# EAGLE design ASM2028 (EAGLE 6.3)
DATABASE: ./../../../../../Components/TinyCircuits_Part_Database.txt
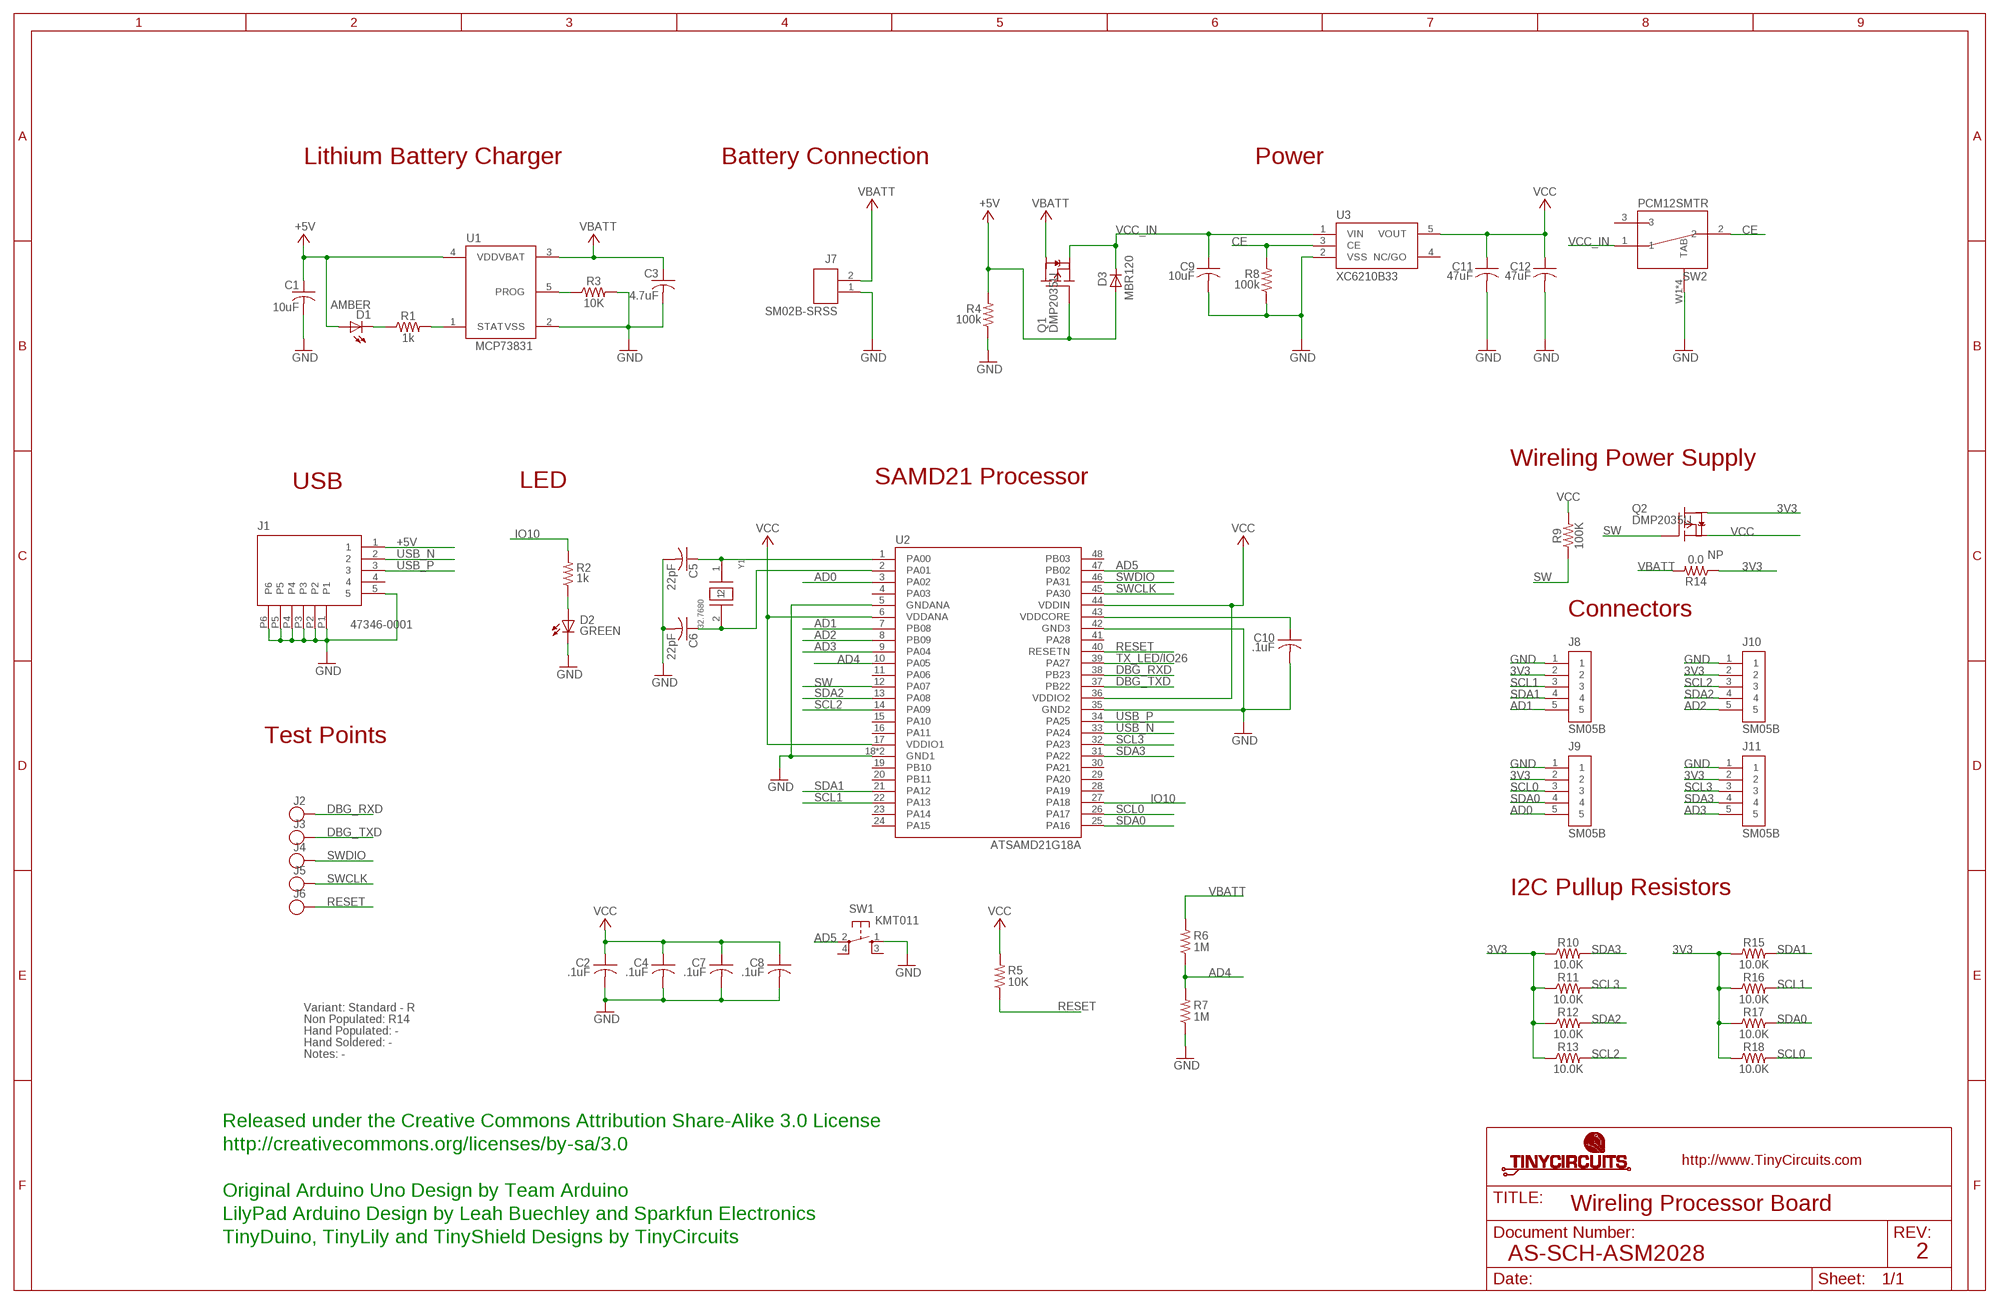
[diagram p0: schematic, sheet 1]

## Parts
C1  10uF  AS-ITM-00002  [C0603]
C2  .1uF  AS-ITM-00008  [C0402]
C3  4.7uF  AS-ITM-00088  [C0603]
C4  .1uF  AS-ITM-00008  [C0402]
C5  22pF  AS-ITM-00211  [C0402]
C6  22pF  AS-ITM-00211  [C0402]
C7  .1uF  AS-ITM-00008  [C0402]
C8  .1uF  AS-ITM-00008  [C0402]
C9  10uF  AS-ITM-00002  [C0603]
C10  .1uF  AS-ITM-00008  [C0402]
C11  47uF  AS-ITM-00558  [C0603]
C12  47uF  AS-ITM-00558  [C0603]
D1  AMBER  AS-ITM-00058  [0402_LED]
D2  GREEN  AS-ITM-00038  [0402_LED]
D3  MBR120  AS-ITM-00111  [SOD-123FL]
J1  47346-0001  AS-ITM-00021  [MICRO_USB]
J2  TEST_POINT  [TEST_POINT_1MM]
J3  TEST_POINT  [TEST_POINT_1MM]
J4  TEST_POINT  [TEST_POINT_1MM]
J5  TEST_POINT  [TEST_POINT_1MM]
J6  TEST_POINT  [TEST_POINT_1MM]
J7  SM02B-SRSS  AS-ITM-00231  [JST_SH_2X1]
J8  SM05B  AS-ITM-00340EDGE  [JST_SH_5X1_EDGE]
J9  SM05B  AS-ITM-00340EDGE  [JST_SH_5X1_EDGE]
J10  SM05B  AS-ITM-00340EDGE  [JST_SH_5X1_EDGE]
J11  SM05B  AS-ITM-00340EDGE  [JST_SH_5X1_EDGE]
Q1  DMP2035U  AS-ITM-00024A  [SOT23A]
Q2  DMP2035U  AS-ITM-00024A  [SOT23A]
R1  1k  AS-ITM-00003  [0402]
R2  1k  AS-ITM-00003  [0402]
R3  10K  AS-ITM-00032  [0402]
R4  100k  AS-ITM-00004  [0402]
R5  10K  AS-ITM-00032  [0402]
R6  1M  AS-ITM-00005  [0402]
R7  1M  AS-ITM-00005  [0402]
R8  100k  AS-ITM-00004  [0402]
R9  100K  AS-ITM-00004  [0402]
R10  10.0K  AS-ITM-00032  [0402]
R11  10.0K  AS-ITM-00032  [0402]
R12  10.0K  AS-ITM-00032  [0402]
R13  10.0K  AS-ITM-00032  [0402]
R14  0.0  AS-ITM-00076  [0402]
R15  10.0K  AS-ITM-00032  [0402]
R16  10.0K  AS-ITM-00032  [0402]
R17  10.0K  AS-ITM-00032  [0402]
R18  10.0K  AS-ITM-00032  [0402]
SW1  KMT011  AS-ITM-00041  [KMT011]
SW2  PCM12SMTR  AS-ITM-00220  [PCM12SMTR]
U1  MCP73831  AS-ITM-00136  [SOT-23]
U2  ATSAMD21G18A  AS-ITM-00273  [QFN48]
U3  XC6210B33  AS-ITM-00046  [SOT-25]
Y1  32.7680  AS-ITM-00279  [ABS06]

## Nets
3V3: J8.2 J9.2 J10.2 J11.2 Q2.C(D) R10.1 R11.1 R12.1 R13.1 R14.1 R15.1 R16.1 R17.1 R18.1
+5V: C1.1 D1.1(A) D3.A J1.1 Q1.B(G) R4.2 U1.4(VDD)
AD0: J9.5 U2.3(PA02)
AD1: J8.5 U2.7(PB08)
AD2: J10.5 U2.8(PB09)
AD3: J11.5 U2.9(PA04)
AD4: R6.1 R7.2 U2.10(PA05)
AD5: SW1.2 U2.47(PB02)
CE: R8.2 SW2.2 U3.3(CE)
DBG_RXD: J2.P$1 U2.38(PB23)
DBG_TXD: J3.P$1 U2.37(PB22)
GND: C1.2 C2.2 C3.2 C4.2 C5.2 C6.2 C7.2 C8.2 C9.2 C10.2 C11.2 C12.2 D2.2(C) J1.5 J1.P1 J1.P2 J1.P3 J1.P4 J1.P5 J1.P6 J7.1 J8.1 J9.1 J10.1 J11.1 R3.2 R4.1 R7.1 R8.1 SW1.1 SW2.W1(TAB) SW2.W2(TAB) SW2.W3(TAB) SW2.W4(TAB) U1.2(VSS) U2.5(GNDANA) U2.18(GND1) U2.35(GND2) U2.42(GND3) U2.EXP(GND1) U3.2(VSS)
IO10: R2.2 U2.27(PA18)
N$1: C5.1 U2.1(PA00) Y1.1
N$3: C6.1 U2.2(PA01) Y1.2
N$4: D2.1(A) R2.1
N$5: D1.2(C) R1.1
N$6: R3.1 U1.5(PROG)
N$7: R1.2 U1.1(STAT)
N$8: C10.1 U2.43(VDDCORE)
RESET: J6.P$1 R5.1 U2.40(RESETN)
SCL0: J9.3 R18.2 U2.26(PA17)
SCL1: J8.3 R16.2 U2.22(PA13)
SCL2: J10.3 R13.2 U2.14(PA09)
SCL3: J11.3 R11.2 U2.32(PA23)
SDA0: J9.4 R17.2 U2.25(PA16)
SDA1: J8.4 R15.2 U2.21(PA12)
SDA2: J10.4 R12.2 U2.13(PA08)
SDA3: J11.4 R10.2 U2.31(PA22)
SW: Q2.B(G) R9.1 U2.12(PA07)
SWCLK: J5.P$1 U2.45(PA30)
SWDIO: J4.P$1 U2.46(PA31)
TX_LED/IO26: U2.39(PA27)
USB_N: J1.2 U2.33(PA24)
USB_P: J1.3 U2.34(PA25)
VBATT: C3.1 J7.2 Q1.C(D) R6.2 R14.2 U1.3(VBAT)
VCC: C2.1 C4.1 C7.1 C8.1 C11.1 C12.1 Q2.E(S) R5.2 R9.2 U2.6(VDDANA) U2.17(VDDIO1) U2.36(VDDIO2) U2.44(VDDIN) U3.5(VOUT)
VCC_IN: C9.1 D3.C Q1.E(S) SW2.1 U3.1(VIN)
Unconnected: J1.4 SW1.3 SW1.4 SW2.3 U2.4(PA03) U2.11(PA06) U2.15(PA10) U2.16(PA11) U2.19(PB10) U2.20(PB11) U2.23(PA14) U2.24(PA15) U2.28(PA19) U2.29(PA20) U2.30(PA21) U2.41(PA28) U2.48(PB03) U3.4(NC/GO)

## Notes on the sheet
- Lithium Battery Charger | Battery Connection | Power
- Wireling Power Supply
- USB | LED | SAMD21 Processor
- NP
- Connectors
- Test Points
- I2C Pullup Resistors
- Variant: Standard - R
- Non Populated: R14
- Hand Populated: -
- Hand Soldered: -
- Notes: -
- Released under the Creative Commons Attribution Share-Alike 3.0 License
- http://creativecommons.org/licenses/by-sa/3.0
- Original Arduino Uno Design by Team Arduino
- Wireling Processor Board
- LilyPad Arduino Design by Leah Buechley and Sparkfun Electronics
- TinyDuino, TinyLily and TinyShield Designs by TinyCircuits
- AS-SCH-ASM2028 | 2

## Library data of the parts
C1 C9 = tinycircuits:AS-ITM-00002: CAP CER 10UF 10V 20% X5R 0603; PARTNO: AS-ITM-00002
C2 C4 C7 C8 C10 = tinycircuits:AS-ITM-00008: CAP CER 0.1UF 16V 10% X5R 0402; PARTNO: AS-ITM-00008; VALUE: 0.1uF
C3 = tinycircuits:AS-ITM-00088: CAP CER 4.7UF 6.3V 20% X5R 0603; PARTNO: AS-ITM-00088
C5 C6 = tinycircuits:AS-ITM-00211: CAP CER 22PF 50V 2% NP0 0402; PARTNO: AS-ITM-00211
C11 C12 = tinycircuits:AS-ITM-00558: CAP CER 47UF 6.3V 20% X5R 0603; PARTNO: AS-ITM-00558
D1 = tinycircuits:AS-ITM-00058: LED 0402 AMBER WTR CLR SMD; PARTNO: AS-ITM-00058
D2 = tinycircuits:AS-ITM-00038: LED 0402 GREEN WTR CLR SMD; PARTNO: AS-ITM-00038; PNPROTATION: 0
D3 = tinycircuits:AS-ITM-00111: DIODE SCHOTTKY 20V 1A SOD123L; PARTNO: AS-ITM-00111; PNPROTATION: 0; VALUE: MBR120VLSFT1G
J1 = tinycircuits:AS-ITM-00021: CONN RCPT 5POS MICRO USB R/A; PARTNO: AS-ITM-00021; PNPROTATION: 90
J2-J6 = tinycircuits:TEST_POINT: Test point, no drill
J7 = tinycircuits:AS-ITM-00231: CONN HEADER SH 2POS SIDE 1MM; PARTNO: AS-ITM-00231; PNPROTATION: 180; VALUE: SM02B-SRSS-TB(LF)(SN)
J8-J11 = tinycircuits:AS-ITM-00340: CONN HEADER SH 5POS SIDE 1MM TIN; PARTNO: AS-ITM-00340; PNPROTATION: 180
Q1 Q2 = tinycircuits:AS-ITM-00024: P-Channel MOSFET SOT-23; PARTNO: AS-ITM-00024; PNPROTATION: 0
R1 R2 = tinycircuits:AS-ITM-00003: RES 1.00K OHM 1/16W 1% 0402; PARTNO: AS-ITM-00003; VALUE: 1.00K
R3 R5 = tinycircuits:AS-ITM-00032: RES 10.0K OHM 1/16W 1% 0402 SMD; PARTNO: AS-ITM-00032; VALUE: 10.0K
R4 R8 = tinycircuits:AS-ITM-00004: RES 100K OHM 1/16W 1% 0402; PARTNO: AS-ITM-00004; VALUE: 100K
R6 R7 = tinycircuits:AS-ITM-00005: RES 1.00M OHM 1/16W 1% 0402; PARTNO: AS-ITM-00005; VALUE: 1.00M
R9 = tinycircuits:AS-ITM-00004: RES 100K OHM 1/16W 1% 0402; PARTNO: AS-ITM-00004
R10-R13 R15-R18 = tinycircuits:AS-ITM-00032: RES 10.0K OHM 1/16W 1% 0402 SMD; PARTNO: AS-ITM-00032
R14 = tinycircuits:AS-ITM-00076: RES 0.0 OHM 1/16W 1% 0402 SMD; PARTNO: AS-ITM-00076
SW1 = tinycircuits:AS-ITM-00041: SWITCH TACTILE SPST-NO 0.05A 32V; PARTNO: AS-ITM-00041
SW2 = tinycircuits:AS-ITM-00220: SW SLIDE SP2T 6VDC 0.3A SMT; PARTNO: AS-ITM-00220; PNPROTATION: 0
U1 = tinycircuits:AS-ITM-00136: IC CONTROLLER LI-ION 4.2V SOT23-5; PARTNO: AS-ITM-00136; PNPROTATION: 270
U2 = tinycircuits:AS-ITM-00273: IC MCU 32BIT 256KB FLASH 48QFN; PARTNO: AS-ITM-00273; PNPROTATION: 270
U3 = tinycircuits:AS-ITM-00046: IC REG LDO 3.3V .7A SOT-25; PARTNO: AS-ITM-00046; PNPROTATION: 270
Y1 = tinycircuits:AS-ITM-00279: Crystal 32.7680kHz 20ppm 12.5pF; PARTNO: AS-ITM-00279; PNPROTATION: 0

## Board
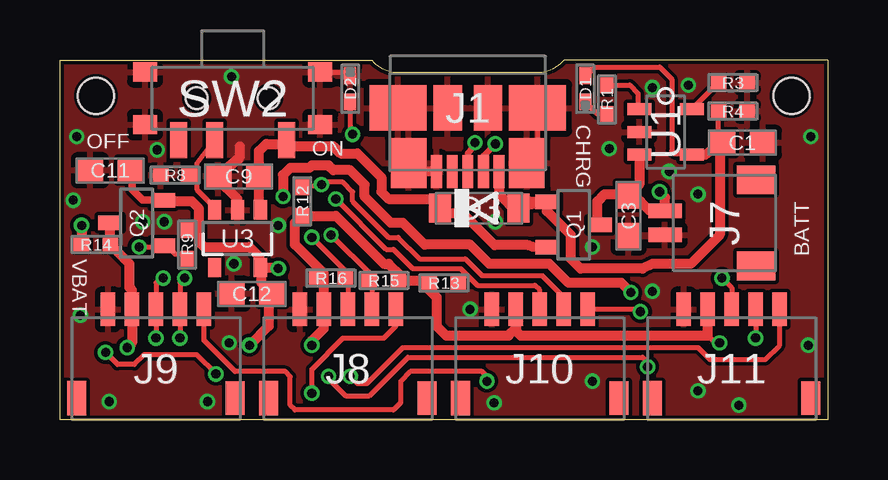
[diagram p1: board, top side]
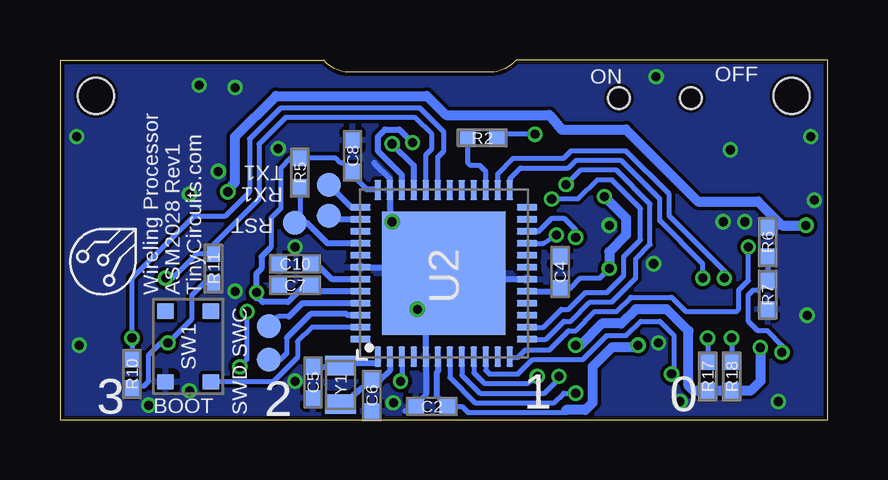
[diagram p2: board, bottom side, seen from below]

Size 32 x 15 mm. Coordinates in mm from the lower left corner, seen from the top.
Outline: 32,15 21,15 arc-45 20.1,14.5 13.9,14.5 arc-45 13,15 0,15 0,0 32,0 32,15
Copper layers (1*16): Top 0.035mm / dielectric 1.5mm / Bottom 0.035mm
Design rules "default *": minimum track width 8mil, minimum drill 15mil, track to track 6mil, track to pad 6mil, pad to pad 6mil, via to via 6mil, smd to smd 6mil, copper to edge 6mil, drill to drill 8mil, minimum pad ring 8mil, minimum via ring 5mil, stop-mask expansion 4mil, vias tented up to drill 25mil, thermal gap 10mil
Holes 1.5 mm at 30.5,13.5 1.5,13.5
bRestrict: 2 lines

### Footprints (pad centres in the part's own frame; a part is rotated, then mirrored left to right if it is on the bottom)
C0603 = smd 1.1 x 1: 1 -0.85,0; 2 0.85,0
C0402 = smd 0.65 x 0.6: 1 -0.65,0; 2 0.65,0
0402_LED = smd 0.7 x 0.5: 1 -0.55,0; 2 0.55,0
SOD-123FL = smd 0.914 x 1.219: A 1.638,0; C -1.638,0
MICRO_USB = smd 1.38 x 0.45: 1 2.66,1.3; 2 2.66,0.65; 3 2.66,0; 4 2.66,-0.65; 5 2.66,-1.3 | smd 2.1 x 1.475: P1 2.3,-2.462; P2 2.3,2.462 | smd 1.9 x 2.375: P3 0,2.913; P4 0,-2.913 | smd 1.9 x 1.175: P5 0,0.838; P6 0,-0.838
TEST_POINT_1MM = smd 1 x 1: P$1 0,0
JST_SH_2X1 = smd 0.6 x 1.4: 1 -0.5,2.475; 2 0.5,2.475 | smd 1.2 x 1.6: PAD1 -1.8,-1.325; PAD2 1.8,-1.325
JST_SH_5X1_EDGE = smd 0.6 x 1.4: 1 -2,2.475; 2 -1,2.475; 3 0,2.475; 4 1,2.475; 5 2,2.475 | smd 0.8 x 1.4: PAD1 -3.3,-1.225; PAD2 3.3,-1.225
SOT23A = smd 0.6 x 1: B -0.95,-1.1; C 0,1.1; E 0.95,-1.1
0402 = smd 0.65 x 0.55: 1 -0.6,0; 2 0.6,0
KMT011 = smd 0.65 x 0.7: 1 -1.475,0.95; 2 -1.475,-0.95; 3 1.475,0.95; 4 1.475,-0.95
PCM12SMTR = smd 0.7 x 1.5: 1 -2.25,1.75; 2 0.75,1.75; 3 2.25,1.75 | smd 1 x 0.8: W1 -3.65,1.1; W2 -3.65,-1.1; W3 3.65,-1.1; W4 3.65,1.1 | hole 0.9: 1.5,0; -1.5,0
SOT-23 = smd 0.5 x 1: 1 -0.95,-1.1; 2 0,-1.1; 3 0.95,-1.1; 4 0.95,1.1; 5 -0.95,1.1
QFN48 = smd 0.85 x 0.28: 1 -3.475,2.75; 2 -3.475,2.25; 3 -3.475,1.75; 4 -3.475,1.25; 5 -3.475,0.75; 6 -3.475,0.25; 7 -3.475,-0.25; 8 -3.475,-0.75; 9 -3.475,-1.25; 10 -3.475,-1.75; 11 -3.475,-2.25; 12 -3.475,-2.75; 25 3.475,-2.75; 26 3.475,-2.25; 27 3.475,-1.75; 28 3.475,-1.25; 29 3.475,-0.75; 30 3.475,-0.25; 31 3.475,0.25; 32 3.475,0.75; 33 3.475,1.25; 34 3.475,1.75; 35 3.475,2.25; 36 3.475,2.75 | smd 0.28 x 0.85: 13 -2.75,-3.475; 14 -2.25,-3.475; 15 -1.75,-3.475; 16 -1.25,-3.475; 17 -0.75,-3.475; 18 -0.25,-3.475; 19 0.25,-3.475; 20 0.75,-3.475; 21 1.25,-3.475; 22 1.75,-3.475; 23 2.25,-3.475; 24 2.75,-3.475; 37 2.75,3.475; 38 2.25,3.475; 39 1.75,3.475; 40 1.25,3.475; 41 0.75,3.475; 42 0.25,3.475; 43 -0.25,3.475; 44 -0.75,3.475; 45 -1.25,3.475; 46 -1.75,3.475; 47 -2.25,3.475; 48 -2.75,3.475 | smd 5.15 x 5.15: EXP 0,0
SOT-25 = smd 0.55 x 0.8: 1 -0.95,-1.2; 2 0,-1.2; 3 0.95,-1.2; 4 0.95,1.2; 5 -0.95,1.2
ABS06 = smd 0.8 x 1.3: 1 -0.8,0; 2 0.8,0

### Placement (x,y rotation side)
C1  28.45,11.55 0 top
C2  16.5,0.55 180 bottom
C3  23.7,8.5 270 top
C4  11.15,6.15 90 bottom
C5  21.45,1.55 270 bottom
C6  19,1 270 bottom
C7  22.2,5.6 180 bottom
C8  19.8,11 90 bottom
C9  7.45,10.15 180 top
C10  22.2,6.5 180 bottom
C11  2.1,10.4 180 top
C12  8,5.25 180 top
D1  21.9,13.8 270 top
D2  12.1,13.8 90 top
D3  17.48,8.82 0 top
J1  17,13 270 top
J2  20.8,8.5 90 bottom
J3  20.8,9.8 90 bottom
J4  23.3,2.5 90 bottom
J5  23.3,3.9 90 bottom
J6  22.2,8.2 90 bottom
J7  27.7,8.2 90 top
J8  12,2.12 0 top
J9  4,2.12 0 top
J10  20,2.12 0 top
J11  28,2.12 0 top
Q1  21.41,8.13 270 top
Q2  3.2,8.2 90 top
R1  22.8,13.35 90 top
R2  14.4,11.75 180 bottom
R3  28.05,14.05 0 top
R4  28.05,12.86 180 top
R5  22,10.3 90 bottom
R6  2.5,7.4 90 bottom
R7  2.5,5.2 90 bottom
R8  4.8,10.2 0 top
R9  5.3,7.3 90 top
R10  29,1.9 90 bottom
R11  25.6,6.3 90 bottom
R12  10.1,9.1 90 top
R13  16,5.7 0 top
R14  1.5,7.3 180 top
R15  13.5,5.8 180 top
R16  11.3,5.9 0 top
R17  5,1.8 90 bottom
R18  4,1.8 90 bottom
SW1  26.65,3.05 90 bottom
SW2  7.2,13.4 180 top
U1  25.25,12 270 top
U2  16,6.1 90 bottom
U3  7.4,7.55 180 top
U$1  [DOCFIELD-TINYCIRCUITS-PCB]  45,-9.9 0 top  (outside the outline)
Y1  20.3,1.45 270 bottom

### Tracks (layer width: path | path; a pad name or v marks a point on that pad's centre or on a via)
3V3  (via drill 0.38)
  Top 0.203: R16.1 10.9,5.9 11,6 | 27,3.5 27.3,3.2 v27.5,3.2 | 10.3,8.7 R12.1 | 15,5.8 15.3,5.8 R13.1 | R15.1 14.2,5.8
  Top 0.406: Q2.C R14.1 2.9,6.5 2.9,5.5 3,5.4 J9.2 3,3.2 v2.8,3 | v10.5,3.1 10.5,3.3 11,3.8 J8.2 11,6 11,6.1 9.8,7.3 9.8,8.2 R12.1 11.5,8.5 13.5,6.5 13.7,6.5 14.2,6 14.2,5.8 15,5.8 15.7,5.1 15.7,3.9 16.1,3.5 18.7,3.5 19,3.8 J10.2 19,3.7 19.2,3.5 27,3.5 J11.2
  Bottom 0.203: R11.1 26,5.7 26.5,5.2 26.5,4.2 v27.5,3.2 27.8,3.2 28.3,2.7 28.3,1.6 28.5,1.4 28.9,1.4 R10.1
  Bottom 0.406: v2.8,3 2.8,1.6 3.2,1.2 R18.1 R17.1 5.6,1.2 5.8,1.4 5.8,3.7 6.7,4.6 8,4.6 8.6,4 9.4,4 10.3,3.1 v10.5,3.1
+5V
  Top 0.203: U1.4 26.3,11.1 25.6,11.1 25.5,11.2 25.5,14.2 25,14.7 22.3,14.7 21.95,14.35 D1.1 | C1.1 27.45,11.7 R4.2
  Top 0.406: Q1.B 20.3,8.69 21.3,7.7 21.3,6.7 21.7,6.3 24.3,6.3 24.7,6.5 26.3,6.5 27.5,7.7 27.5,11.5 27.55,11.55 C1.1 26.9,11.05 U1.4 | J1.1 18.3,9.4 18.74,8.96 19.24,8.96 19.16,8.88 | 19.21,9.12 Q1.B | Q1.B 19.16,8.88 | 19.16,8.88 D3.A
AD0  (via drill 0.38)
  Top 0.203: v17.8,1.6 17.8,1.8 17.6,2 14.6,2 14.2,1.6 14.2,0.7 13.9,0.4 9.8,0.4 9.6,0.6 9.6,1.8 9.4,2 7.3,2 6,3.3 J9.5
  Bottom 0.203: U2.3 17.75,1.55 v17.8,1.6
AD1  (via drill 0.38)
  Top 0.203: v10.5,1.1 10.5,2.1 11.8,3.4 13.5,3.4 14,3.9 J8.5
  Bottom 0.203: U2.7 15.75,1.75 14.7,0.7 11.4,0.7 11,1.1 v10.5,1.1
AD2  (via drill 0.38)
  Top 0.203: v11.2,1.8 11.2,1.7 11.9,1 12.9,1 14.5,2.6 24.3,2.6 24.5,2.4 v24.5,2.2 | v24.2,4.5 24.1,4.6 J10.5
  Bottom 0.203: U2.8 15.25,1.85 14.5,1.1 11.8,1.1 11.2,1.7 v11.2,1.8 | v24.5,2.2 24.2,2.5 v24.2,4.5
AD3  (via drill 0.38)
  Top 0.203: v12.1,1.8 12.4,1.5 12.8,1.5 14.3,3 26.6,3 27.1,2.5 29.4,2.5 30,3.1 J11.5
  Bottom 0.203: U2.9 14.75,1.95 14.3,1.5 12.5,1.5 v12.1,1.8
AD4  (via drill 0.38)
  Top 0.203: v6.5,1.9 5.7,2.7 3.5,2.7 3.1,2.3 2.4,2.3 v1.9,2.8
  Bottom 0.203: U2.10 14.25,2.05 14.1,1.9 12.9,1.9 12.3,2.5 10.2,2.5 9.2,3.5 8.4,3.5 7.8,4.1 7,4.1 6.4,3.5 6.4,1.9 v6.5,1.9 | R6.1 R7.2 | R7.2 2.7,5.8 | v1.9,2.8 1.9,3.1 2.5,3.7 2.9,3.7 3.3,4.1 3.3,5.2 3.1,5.4 2.9,5.4 R7.2
AD5
  Bottom 0.203: U2.47 21.5,3.85 22.1,3.25 22.1,2.6 23.12,1.57 SW1.2
CE
  Top 0.203: SW2.2 5.7,10.68 5.7,10 | 5.7,10 5.7,9.6 6.45,8.85 U3.3 | 5.1,10 R8.2 5.7,10
DBG_RXD
  Bottom 0.254: U2.38 20.65,8.35 J2.P$1
DBG_TXD
  Bottom 0.254: U2.37 19.85,8.85 J3.P$1
GND  (via drill 0.38)
  Top 0.203: J1.P1 15.14,10.9 14.2,10.9 | SW2.W2 11.95,14.5 D2.2 | J1.P3 19.91,11.15 J1.P2
  Top 0.406: C9.2 7.5,10.95 7.5,11.4 | U3.2 7.4,9.2 6.6,10 | J1.5 14.9,10.34 J1.P1
  Bottom 0.203: U2.EXP 16,6.35 17.1,6.35 17.2,5.05 v17.1,4.6 | 16,4.5 16.35,4.15 16.75,4.15 | 13.95,5.95 14,5.9 14,5.85
  Bottom 0.254: U2.42 17.1,6.35 | U2.EXP v18.15,8.25 18.25,8.2 U2.35 18.25,10.05 18.9,10.7 | U2.EXP 16,4.5 | U2.18 14,5.85 15.75,5.85 U2.EXP | 17.6,0.35 C2.2 17.15,0.65 16.75,1.05 U2.5 16.75,4.15
  other vias: 0.7,11.8 7.15,14.3 22.2,1.6 24.7,13.85 22.9,11.3 4.35,8.25 9.1,8.1 25.4,10.35 0.85,4.35 7.25,6.5 3.45,8.25 24.7,5.35 7.05,3.2 2.05,0.75 26.6,1.2 28.3,0.6 31.2,3.1 31.3,11.8 26.6,9.4 22.2,7.2 18.1,0.7 26.2,13.95 6.15,0.75 0.55,9.15 4.05,11.25
  pour Top: 32,15 32,0 0,0 0,15
  pour Bottom: 32,15 32,0 0,0 0,15
IO10
  Bottom 0.203: U2.27 14.25,10.35 14.5,10.6 14.9,10.6 15,10.7 R2.2
N$1
  Bottom 0.254: C5.1 20.65,2.2 | 20.65,2.2 Y1.1 | U2.1 18.75,2.35 20.2,2.35 20.65,2.2
N$3
  Bottom 0.254: U2.2 18.25,2.05 18.65,1.65 C6.1 19.8,1 Y1.2
N$4  (via drill 0.38)
  Top 0.203: D2.1 12.1,12 v12.2,11.9
  Bottom 0.203: v12.2,11.9 13.65,11.9 R2.1
N$5
  Top 0.203: R1.1 22.4,12.75 D1.2
N$6
  Top 0.203: U1.5 R3.1
N$7
  Top 0.203: R1.2 23.75,13.95 24.1,13.6 24.1,13 U1.1
N$8
  Bottom 0.254: U2.43 20.65,5.85 21.4,6.6 C10.1 21.45,6.55
RESET
  Bottom 0.203: 22,9.6 22,8.3 J6.P$1 21.7,8.2
  Bottom 0.254: U2.40 20.85,7.35 21.7,8.2 | R5.1 22,9.6
SCL0  (via drill 0.38)
  Top 0.203: v4.3,5.9 4,5.7 J9.3 v4,3.4
  Bottom 0.203: U2.26 13.75,10.25 13.1,10.9 11,10.9 10.7,11.2 8.4,11.2 6.6,9.4 6.6,8.5 4.2,6.1 v4.3,5.9 | v4,3.4 R18.2
SCL1  (via drill 0.38)
  Top 0.203: v10.5,7.6 12,6.1 12,6 | 12,6 J8.3 | R16.2 12,6
  Bottom 0.203: U2.22 12.05,7.85 11.5,8.4 11,8.4 10.5,7.9 v10.5,7.6
SCL2  (via drill 0.38)
  Top 0.203: J10.3 20,5.4 19.8,5.6 17.4,5.6 16.95,6.05 | 16.95,6.05 16.7,6.3 14.7,6.3 13.9,7.1 13.6,7.1 v11.5,9.2 | R13.2 16.95,6.05
  Bottom 0.203: U2.14 11.85,3.85 11.1,4.6 10.8,4.6 10.1,5.3 9.2,5.3 8.5,6 8.5,6.8 7.8,7.5 7.8,8.8 9,10 9.6,10 10.4,9.2 v11.5,9.2 11.5,9.1 11.4,9.2
SCL3  (via drill 0.38)
  Top 0.203: v27.6,5.9 28,5.5 J11.3
  Bottom 0.203: U2.32 16.75,11.05 16.5,11.3 16.5,11.9 17.2,12.6 22.6,12.6 23.7,11.5 23.7,9.2 25.6,7.3 R11.2 26.3,6.9 27.3,5.9 v27.6,5.9
SDA0  (via drill 0.38)
  Top 0.203: v5.2,5.9 5,5.7 J9.4 v5,3.4
  Bottom 0.203: U2.25 13.25,10.05 12.8,10.5 10.8,10.5 10.5,10.8 8.6,10.8 7,9.2 7,8.3 5.2,6.5 v5.2,5.9 | v5,3.4 R17.2
  Bottom 0.254: U2.25 13.23,9.6
SDA1  (via drill 0.38)
  Top 0.203: v11.3,7.7 13,6 13,5.9 | 13,5.9 J8.4 | 13,5.9 R15.2
  Bottom 0.203: U2.21 11.85,7.35 v11.3,7.7
SDA2  (via drill 0.38)
  Top 0.203: J10.4 21,5.1 20.1,6 17.6,6 16.9,6.7 15,6.7 14.1,7.6 13.7,7.6 12.2,9.1 12.2,9.5 11.8,9.9 11.1,9.9 11,9.8 v10.9,9.8 R12.2
  Bottom 0.203: U2.13 11.75,3.35 11,4.1 10.7,4.1 9.9,4.9 9,4.9 8,5.9 8,6.7 7.4,7.3 7.4,9 8.8,10.4 10.3,10.4 v10.9,9.8
SDA3  (via drill 0.38)
  Top 0.203: J11.4 v29,3.4
  Bottom 0.203: U2.31 16.25,10.95 16,11.2 16,12 17,13 22.8,13 24.1,11.7 24.1,9.5 25.1,8.5 26.4,8.5 29,5.9 v29,3.4 R10.2
SW  (via drill 0.38)
  Top 0.203: v3.3,7.2 4.35,7.2 | 4.35,7.2 Q2.B | 4.35,7.2 4.5,7.2 4.8,6.9 5.1,6.9 R9.1
  Bottom 0.203: U2.12 13.25,2.6 12.9,2.6 12.6,2.9 11.6,2.9 10.8,3.7 10.5,3.7 9.7,4.5 8.8,4.5 8.2,5.1 6.5,5.1 5.9,4.5 3.8,4.5 3.7,4.6 3.7,5.4 3.3,5.8 v3.3,7.2
SWCLK
  Bottom 0.203: 22.45,4.3 22.9,4.3 J5.P$1
  Bottom 0.254: U2.45 21.9,4.85 22.45,4.3
SWDIO
  Bottom 0.203: 22.55,3.4 22.55,2.75 22.8,2.5 J4.P$1
  Bottom 0.254: 22.55,3.4 21.55,4.4 20.05,4.4 20,4.35 U2.46
USB_N  (via drill 0.38)
  Top 0.254: v18.15,11.5 17.65,11 J1.2
  Bottom 0.254: U2.33 17.25,10.6 v18.15,11.5
USB_P  (via drill 0.38)
  Top 0.254: v17.3,11.55 17.3,11.5 17,11.1 J1.3
  Bottom 0.254: U2.34 17.75,10.2 18.75,11.2 18.75,11.8 18.45,12.1 17.85,12.1 v17.3,11.55
VBATT  (via drill 0.38)
  Top 0.406: C3.1 23.95,9.1 24.2,9.1 24.6,8.7 J7.2 25.23,9.28 v25,9.5 | U1.3 24.15,9.8 C3.1 | Q1.C 22.41,8.31 22.4,8.6 22.4,9.1 22.7,9.4 23.65,9.4 C3.1 | v0.9,8.1 R14.2
  Bottom 0.203: R6.2 v0.9,8.1
  Bottom 0.406: v25,9.5 25,9.6 24.7,9.9 24.7,11.8 23,13.5 16.7,13.5 15.9,12.7 11.6,12.7 11.1,12.1 8.4,12.1 5.4,9.1 2.9,9.1 1.9,8.1 v0.9,8.1
VCC  (via drill 0.38)
  Top 0.203: R9.2 5.8,7.9
  Top 0.305: Q2.E 3.45,9.15 3,9.6 3,10.35 C11.1
  Top 0.406: U3.5 8.4,6.3 8.4,5.7 C12.1 8.7,5.1 8.7,3.9 v7.9,3.1 | U3.5 8.3,6.4 8.3,6.8 7.9,7.2 6,7.2 5.8,7.4 5.8,7.9 5.8,8.8 5.5,9.1 4.45,9.1 Q2.E | v23.8,5.3 23.4,5.7 21.2,5.7 20.4,6.5 17.9,6.5 17.1,7.3 15.2,7.3 14.3,8.2 13.8,8.2 12.7,9.3 12.7,9.8 12.1,10.4 11.4,10.4 11.2,10.6 10.5,10.6 10.4,10.5 9.6,10.5 9.3,10.2 v9.3,9.3 | U3.5 9.15,6.35 v9.1,6.3
  Bottom 0.203: 19.2,9.6 19.95,10.35 | 19.95,10.35 C8.1 | 19.95,10.35 19.95,10.45 20.2,10.7 20.3,10.7 20.5,10.9 R5.2 22.4,10.9 22.8,10.5 22.8,8.8 23.2,8.4 23.2,7.2 23.25,7.15 | 10.9,0.4 11,0.3 15,0.3 15.25,0.55 C2.1 16.3,1 | 11.1,5.45 C4.1 | 11.05,5.45 10.75,5.45 10.3,5.9 9.5,5.9 v9.1,6.3
  Bottom 0.254: U2.17 11.25,5.35 11.05,5.45 C4.1 | U2.44 21.3,5.35 21.4,5.5 C7.1 21.7,5.7 22.5,4.9 23.55,4.9 23.8,5.15 | U2.36 18.77,9.6 19.2,9.6 | 23.25,7.15 23.6,6.8 23.6,6.3 23.8,6.1 v23.8,5.3 | U2.6 16.25,2 16.3,1.95 16.3,1
  Bottom 0.406: v7.9,3.1 8,3 9,3 9.8,2.2 9.8,0.7 10.1,0.4 10.9,0.4 | 23.8,5.15 v23.8,5.3 | v9.3,9.3 8.4,8.4 8.4,7.7 9.1,7 v9.1,6.3
VCC_IN
  Top 0.203: SW2.1 9.68,11.56 9.68,11.51
  Top 0.406: Q1.E 19.7,7.2 19.52,7.28 18.12,7.28 16.8,8.6 15.86,8.6 D3.C 15.88,8.82 15.5,9.2 13.7,9.2 13.4,9.5 13.4,10.1 12.4,11.1 11.7,11.1 11.4,11.4 9.7,11.4 SW2.1 9.3,11.5 8.6,11.5 8.3,11.2 C9.1 8.3,8.95 U3.1

### Text on the board
tPlace: CHRG | OFF | ON | BATT | VBAT
bPlace: OFF | ON | RX1 | TX1 | RST | TinyCircuits.com | ASM2028 Rev1 | Wireling Processor | SWC | 0 | 1 | 2 | BOOT | 3 | SWD
Document: FABRICATION DRAWING | NOTES: | 1. PRINTED CIRCUIT BOARD MADE FROM NEMA GRADE FR-4 EPOXY LAMINATE | WITH 1 OUNCE COPPER PLATING AND .024 THICKNESS. | 2. ALL DIMENSIONS ARE GIVEN IN INCHES. | 3. CIRCUIT PATHS ARE FOR REFERENCE ONLY. | 4. HOLE SIZES SHOWN ARE FINISHED DIAMETERS AFTER PLATING. | 5. BOARD PLATED USING REFLOW OR SIMILAR METHOD. | 6. BOARD TO HAVE BLUE SOLDER MASK ON PLATED SURFACES USING WET FILM | 7. SILKSCREEN BOARD USING WHITE INK. | SR100 OR SR1010 EPOXY. EQUIVALENT WET OR DRY FILM MAY BE USED. | 8. THE FOLLOWING INFORMATION APPLIES TO THIS BOARD: | * 2 COPPER LAYERS | * .024 BOARD THICKNESS | * REQUIRES TOP SIDE SILKSCREEN | Released under the Creative Commons Attribution Share-Alike 3.0 License | http://creativecommons.org/licenses/by-sa/3.0 | LilyPad Arduino Design by Leah Buechley and Sparkfun Electronics | Original Arduino Uno Design by Team Arduino | TinyDuino, TinyLily and TinyShield Designs by TinyCircuits | Wireling Processor Board | AS-PCB-ASM2028 | 2